# EAGLE schematic controller (EAGLE 9.2.2)
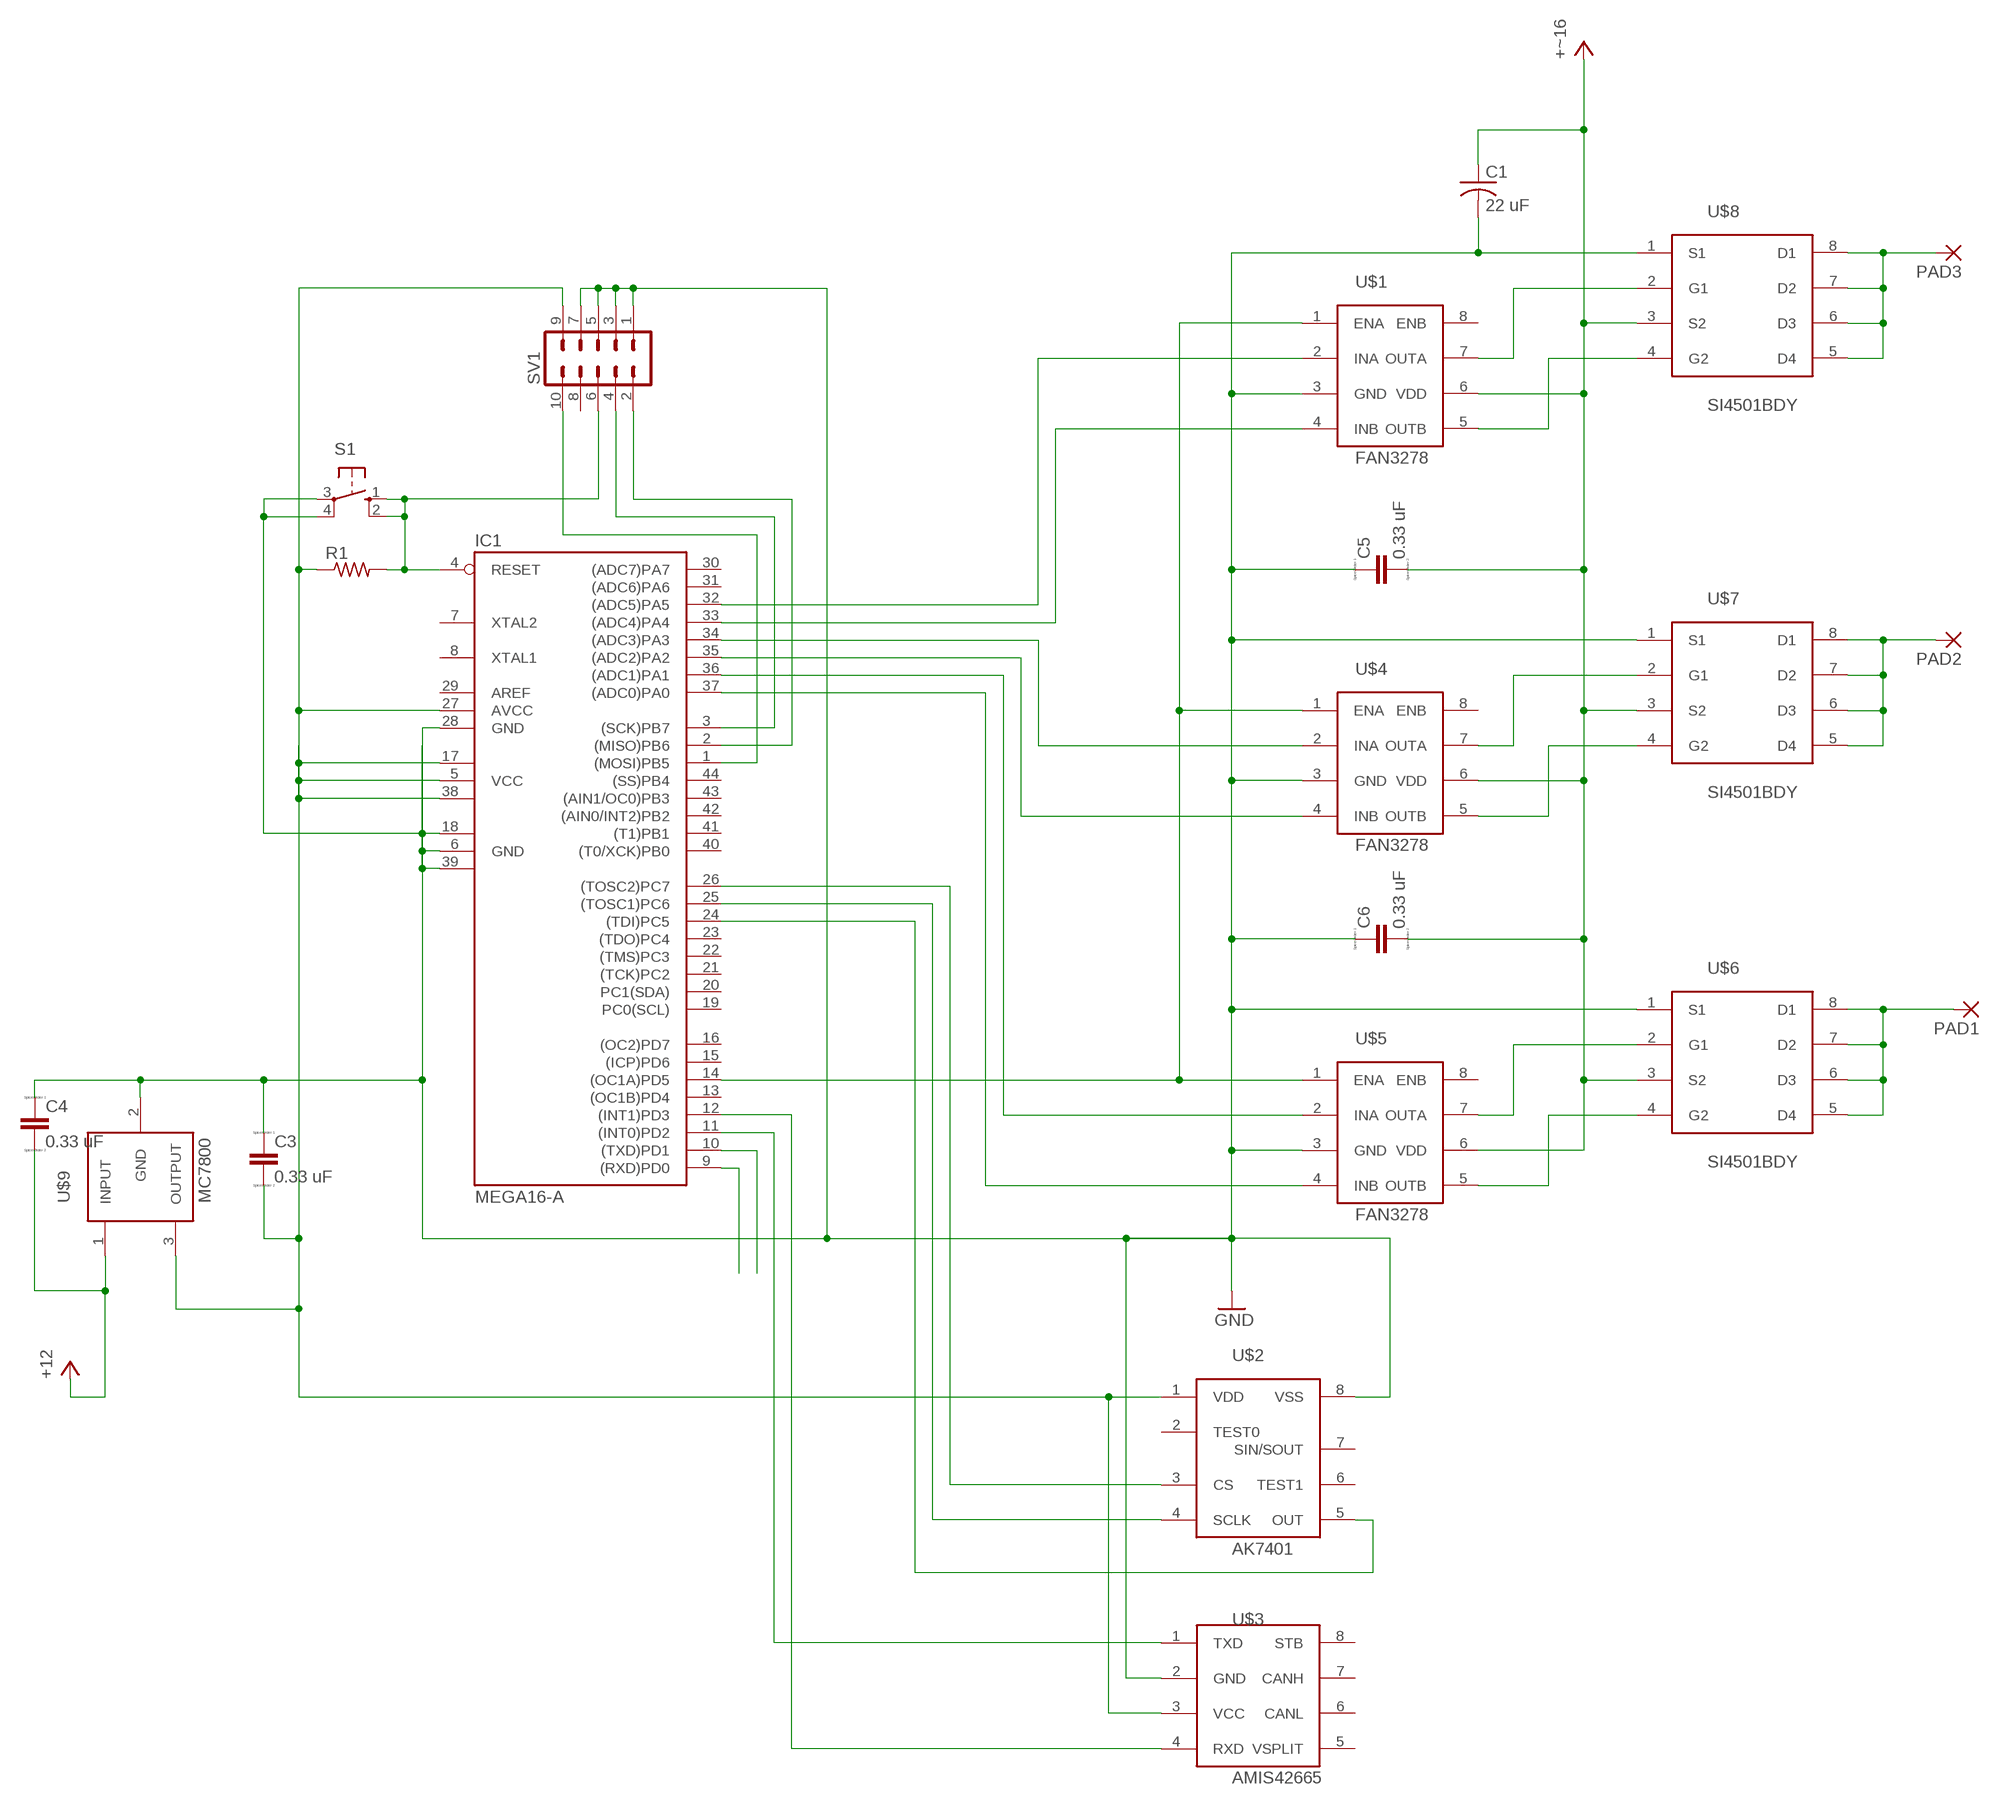
[diagram p0: schematic, sheet 1]

## Parts
C1  22 uF  C-USC1206  [C1206]
C3  0.33 uF  CC1206  [C1206]
C4  0.33 uF  CC1206  [C1206]
C5  0.33 uF  CC1206  [C1206]
C6  0.33 uF  CC1206  [C1206]
IC1  MEGA16-A  [TQFP44]
PAD1  2,54/1,0  [2,54/1,0]
PAD2  2,54/1,0  [2,54/1,0]
PAD3  2,54/1,0  [2,54/1,0]
R1  R-US_M1206  [M1206]
S1  10-XX  [B3F-10XX]
SV1  MA05-2  [MA05-2]
U$1  FAN3278  [SOIC-8]
U$2  AK7401  [SOIC-8]
U$3  AMIS42665  [SOIC-8]
U$4  FAN3278  [SOIC-8]
U$5  FAN3278  [SOIC-8]
U$6  SI4501BDY  [SOIC-8]
U$7  SI4501BDY  [SOIC-8]
U$8  SI4501BDY  [SOIC-8]
U$9  MC7800  [TO252]

## Nets
GND: C1.2 C3.1 C4.1 C5.1 C6.1 IC1.6(GND) IC1.18(GND1) IC1.28(GND) IC1.39(GND2) S1.3(P) S1.4(P1) SV1.1 SV1.3 SV1.5 SV1.7 U$1.3(GND) U$2.8(VSS) U$3.2(GND) U$4.3(GND) U$5.3(GND) U$6.1(S1) U$7.1(S1) U$8.1(S1) U$9.2(GND)
N$1: U$1.7(OUTA) U$8.2(G1)
N$2: U$1.5(OUTB) U$8.4(G2)
N$3: U$4.7(OUTA) U$7.2(G1)
N$4: U$4.5(OUTB) U$7.4(G2)
N$5: U$5.7(OUTA) U$6.2(G1)
N$6: U$5.5(OUTB) U$6.4(G2)
N$7: PAD1.1(P) U$6.5(D4) U$6.6(D3) U$6.7(D2) U$6.8(D1)
N$8: PAD2.1(P) U$7.5(D4) U$7.6(D3) U$7.7(D2) U$7.8(D1)
N$9: PAD3.1(P) U$8.5(D4) U$8.6(D3) U$8.7(D2) U$8.8(D1)
N$10: IC1.1((MOSI)PB5) SV1.10
N$11: IC1.4(RESET) R1.2 S1.1(S) S1.2(S1) SV1.6
N$12: IC1.3((SCK)PB7) SV1.4
N$13: IC1.2((MISO)PB6) SV1.2
N$14: C3.2 IC1.5(VCC) IC1.17(VCC1) IC1.27(AVCC) IC1.38(VCC2) R1.1 SV1.9 U$2.1(VDD) U$3.3(VCC) U$9.3(OUTPUT)
N$16: IC1.14((OC1A)PD5) U$1.1(ENA) U$4.1(ENA) U$5.1(ENA)
N$17: IC1.11((INT0)PD2) U$3.1(TXD)
N$18: IC1.12((INT1)PD3) U$3.4(RXD)
N$19: IC1.26((TOSC2)PC7) U$2.3(CS)
N$20: IC1.25((TOSC1)PC6) U$2.4(SCLK)
N$21: IC1.24((TDI)PC5) U$2.5(OUT)
N$22: IC1.10((TXD)PD1)
N$23: IC1.9((RXD)PD0)
N$24: IC1.37((ADC0)PA0) U$5.4(INB)
N$25: IC1.36((ADC1)PA1) U$5.2(INA)
N$26: IC1.35((ADC2)PA2) U$4.4(INB)
N$27: IC1.34((ADC3)PA3) U$4.2(INA)
N$28: IC1.33((ADC4)PA4) U$1.4(INB)
N$29: IC1.32((ADC5)PA5) U$1.2(INA)
VCC: C1.1 C4.2 C5.2 C6.2 U$1.6(VDD) U$4.6(VDD) U$5.6(VDD) U$6.3(S2) U$7.3(S2) U$8.3(S2) U$9.1(INPUT) ; supply symbol labelled +~16, +12
Unconnected: IC1.7(XTAL2) IC1.8(XTAL1) IC1.13((OC1B)PD4) IC1.15((ICP)PD6) IC1.16((OC2)PD7) IC1.19(PC0(SCL)) IC1.20(PC1(SDA)) IC1.21((TCK)PC2) IC1.22((TMS)PC3) IC1.23((TDO)PC4) IC1.29(AREF) IC1.30((ADC7)PA7) IC1.31((ADC6)PA6) IC1.40((T0/XCK)PB0) IC1.41((T1)PB1) IC1.42((AIN0/INT2)PB2) IC1.43((AIN1/OC0)PB3) IC1.44((SS)PB4) SV1.8 U$1.8(ENB) U$2.2(TEST0) U$2.6(TEST1) U$2.7(SIN/SOUT) U$3.5(VSPLIT) U$3.6(CANL) U$3.7(CANH) U$3.8(STB) U$4.8(ENB) U$5.8(ENB)

## Library data of the parts
C1 = rcl:C-US: CAPACITOR, American symbol; SPICEPREFIX: C
C3-C6 = eagle-ltspice:C: CAPACITOR, European symbol; SPICEMODEL: NONE; SPICEPREFIX: C
IC1 = atmel:MEGA16: MICROCONTROLLER 16 Kbytes FLASH 1 kbytes SRAM 512 bytes EEPROM USART 8-channel 10 bit ADC Source: avr.lbr; MPN: ATMEGA16-16AU; OC_FARNELL: 9171134; OC_NEWARK: 96K6515
PAD1-PAD3 = wirepad:2,54/1,0: THROUGH-HOLE PAD
R1 = rcl:R-US_: RESISTOR, American symbol; SPICEPREFIX: R
S1 = switch-omron:10-XX: OMRON SWITCH; MPN: B3F-1000; OC_FARNELL: 176432; OC_NEWARK: 36M3542
SV1 = con-lstb:MA05-2: PIN HEADER; OC_FARNELL: unknown; OC_NEWARK: unknown
U$1 U$4 U$5 = my library:FAN3278: Pmos Nmos bridge driver
U$2 = my library:AK7401: Non-contact magnetic encoder
U$3 = my library:AMIS42665: CAN bus to UART transceiver
U$6-U$8 = my library:SI4501BDY: Pmos Nmos half bridge
U$9 = my library:MC7800: 5v LDO dpak case (to-252-3)

## Net classes
0 default: width 0.508 mm, clearance 0.381 mm